# EAGLE schematic IOIO-OTG-v20 (EAGLE 6.3)
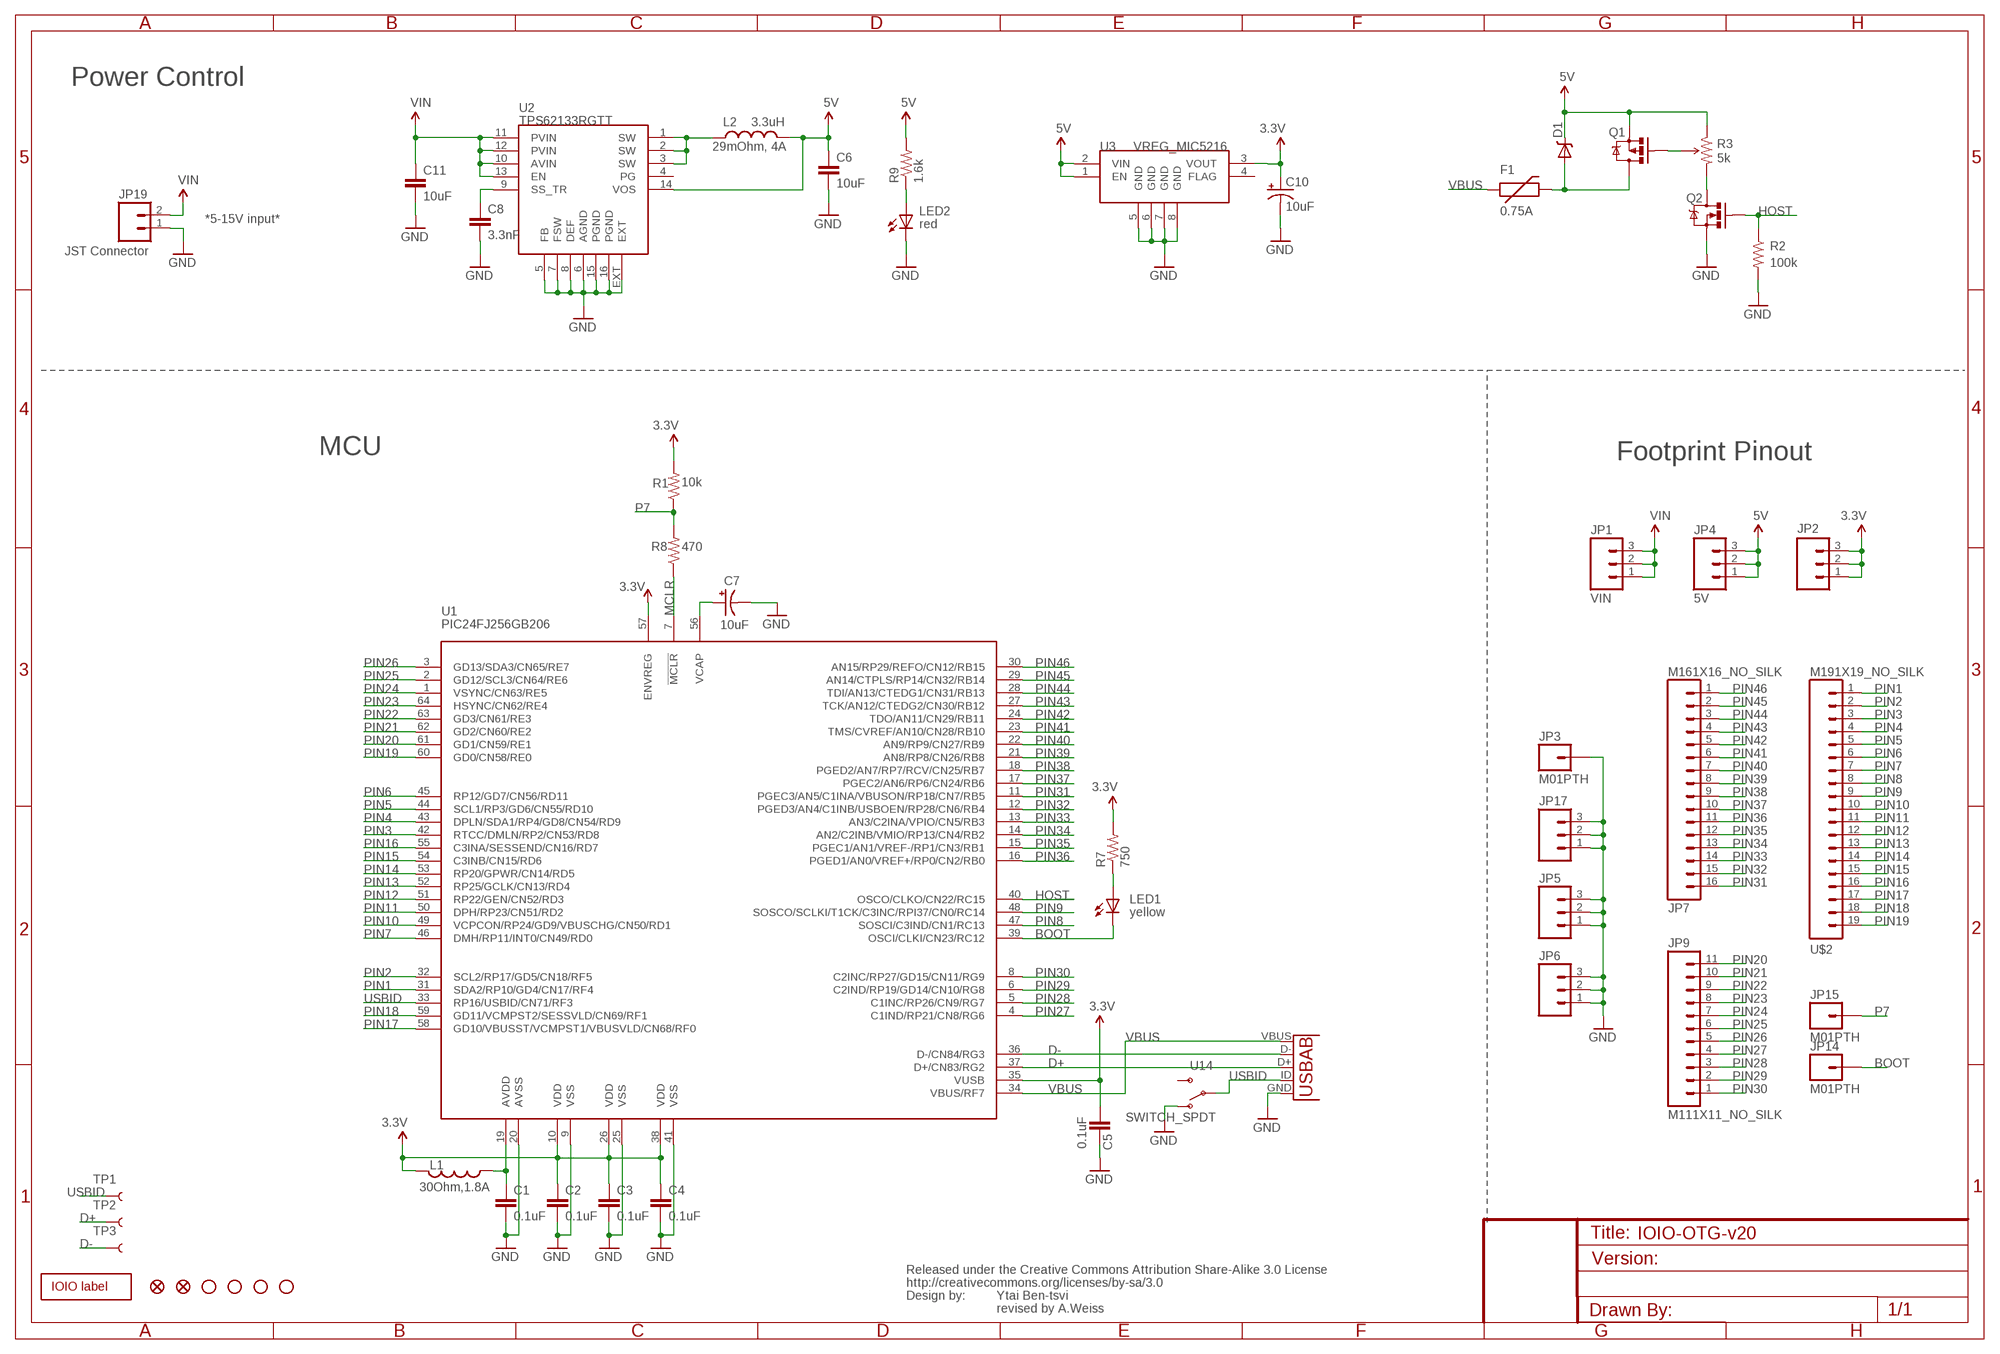
[diagram p0: schematic, sheet 1]

## Parts
C1  0.1uF  CAP0402-CAP  [0402-CAP]
C2  0.1uF  CAP0402-CAP  [0402-CAP]
C3  0.1uF  CAP0402-CAP  [0402-CAP]
C4  0.1uF  CAP0402-CAP  [0402-CAP]
C5  0.1uF  CAP0402-CAP  [0402-CAP]
C6  10uF  CAP0805  [0805]
C7  10uF  CAP_POL1206  [EIA3216]
C8  3.3nF  CAP0402-CAP  [0402-CAP]
C10  10uF  CAP_POL1206  [EIA3216]
C11  10uF  CAP1210  [1210]
D1  B340A  DIODE-SCHOTTKY_  [SMA-DIODE]
F1  PTCSMD  [PTC-1206]
JP1  VIN  M03PTH  [1X03]
JP2  M03PTH  [1X03]
JP3  M01PTH  [1X01]
JP4  5V  M03PTH  [1X03]
JP5  M03PTH  [1X03]
JP6  M03PTH  [1X03]
JP7  M161X16_NO_SILK  [1X16_NO_SILK]
JP8  FIDUCIALUFIDUCIAL  [MICRO-FIDUCIAL]
JP9  M111X11_NO_SILK  [1X11_NO_SILK]
JP10  STAND-OFF  [STAND-OFF]
JP11  STAND-OFF  [STAND-OFF]
JP12  STAND-OFF  [STAND-OFF]
JP13  STAND-OFF  [STAND-OFF]
JP14  M01PTH  [1X01]
JP15  M01PTH  [1X01]
JP16  FIDUCIALUFIDUCIAL  [MICRO-FIDUCIAL]
JP17  M03PTH  [1X03]
JP19  JST Connector  M02-JST-2MM-SMT  [JST-2-SMD]
L1  30Ohm,1.8A  INDUCTOR0402  [C0402]
L2  VLC5045T-3R3N  INDUCTORCR54  [CR54]
LED1  LY L29K-J1K2-26-Z  LED0603  [LED-0603]
LED2  LS L29K-G1J2-1-Z  LED0603  [LED-0603]
Q1  IRLML2244  MOSFET-PCHANNELSMD  [SOT23-3]
Q2  2N7002PW  MOSFET-NCHANNELSOT323  [SOT323]
R1  10k  RESISTOR0402-RES  [0402-RES]
R2  100k  RESISTOR0402-RES  [0402-RES]
R3  TS53YL502MR10  TRIMPOTTRIMPOT-5MM  [TRIMPOT-5MM]
R7  750  RESISTOR0402-RES  [0402-RES]
R8  470  RESISTOR0402-RES  [0402-RES]
R9  1.6k  RESISTOR0402-RES  [0402-RES]
TP1  TEST-POINT3  [PAD.03X.03]
TP2  TEST-POINT3  [PAD.03X.03]
TP3  TEST-POINT3  [PAD.03X.03]
U1  PIC24FJ256GB206  PIC24FXXXDAX06  [PIC24FXXX_TQFP64]
U2  TPS62133RGTT  TPS6214X  [QFN16-3X3MM]
U3  VREG_MIC5216  [MSOP8]
U14  SWITCH_SPDT  [KPS-1290]
U$1  CREATIVE_COMMONS  [CREATIVE_COMMONS]
U$2  M191X19_NO_SILK  [1X19_NO_SILK]
U$3  10104111-0001LF  USB_AB  [USB-AB-MICRO-SMD]
U$6  IOIO-OTG  [IOIO-OTG-COPPER-EXPOSED]

## Nets
3.3V: C2.1 C3.1 C4.1 C5.1 C10.A(+) JP2.1 JP2.2 JP2.3 L1.2 R1.2 R7.2 U1.10(VDD) U1.26(VDD) U1.35(VUSB) U1.38(VDD) U1.57(ENVREG) U3.3(VOUT)
5V: C6.1 D1.C JP4.1 JP4.2 JP4.3 L2.P$2 Q1.2(S) R3.A(CCW) R9.2 U2.14(VOS) U3.1(EN) U3.2(VIN)
BOOT: JP14.1 LED1.C U1.39(OSCI/CLKI/CN23/RC12)
D+: TP2.P$1 U1.37(D+/CN83/RG2) U$3.D+
D-: TP3.P$1 U1.36(D-/CN84/RG3) U$3.D-
GND: C1.2 C2.2 C3.2 C4.2 C5.2 C6.2 C7.C(-) C8.2 C10.C(-) C11.2 JP3.1 JP5.1 JP5.2 JP5.3 JP6.1 JP6.2 JP6.3 JP17.1 JP17.2 JP17.3 JP19.1 LED2.C Q2.2(S) R2.2 U1.9(VSS) U1.20(AVSS) U1.25(VSS) U1.41(VSS) U2.5(FB) U2.6(AGND) U2.7(FSW) U2.8(DEF) U2.15(PGND) U2.16(PGND) U2.EXT U3.5(GND) U3.6(GND) U3.7(GND) U3.8(GND) U14.O U$3.GND
HOST: Q2.1(G) R2.1 U1.40(OSCO/CLKO/CN22/RC15)
MCLR: R8.1 U1.7(!MCLR)
N$1: Q1.1(G) R3.B(WIPER)
N$2: LED1.A R7.1
N$3: LED2.A R9.1
N$4: D1.A F1.2 Q1.3(D)
N$5: C7.A(+) U1.56(VCAP)
N$6: L2.P$1 U2.1(SW) U2.2(SW) U2.3(SW)
N$7: C8.1 U2.9(SS_TR)
N$8: Q2.3(D) R3.C(CW)
N$9: C1.1 L1.1 U1.19(AVDD)
P7: JP15.1 R1.1 R8.2
PIN1: U1.31(SDA2/RP10/GD4/CN17/RF4) U$2.1
PIN2: U1.32(SCL2/RP17/GD5/CN18/RF5) U$2.2
PIN3: U1.42(RTCC/DMLN/RP2/CN53/RD8) U$2.3
PIN4: U1.43(DPLN/SDA1/RP4/GD8/CN54/RD9) U$2.4
PIN5: U1.44(SCL1/RP3/GD6/CN55/RD10) U$2.5
PIN6: U1.45(RP12/GD7/CN56/RD11) U$2.6
PIN7: U1.46(DMH/RP11/INT0/CN49/RD0) U$2.7
PIN8: U1.47(SOSCI/C3IND/CN1/RC13) U$2.8
PIN9: U1.48(SOSCO/SCLKI/T1CK/C3INC/RPI37/CN0/RC14) U$2.9
PIN10: U1.49(VCPCON/RP24/GD9/VBUSCHG/CN50/RD1) U$2.10
PIN11: U1.50(DPH/RP23/CN51/RD2) U$2.11
PIN12: U1.51(RP22/GEN/CN52/RD3) U$2.12
PIN13: U1.52(RP25/GCLK/CN13/RD4) U$2.13
PIN14: U1.53(RP20/GPWR/CN14/RD5) U$2.14
PIN15: U1.54(C3INB/CN15/RD6) U$2.15
PIN16: U1.55(C3INA/SESSEND/CN16/RD7) U$2.16
PIN17: U1.58(GD10/VBUSST/VCMPST1/VBUSVLD/CN68/RF0) U$2.17
PIN18: U1.59(GD11/VCMPST2/SESSVLD/CN69/RF1) U$2.18
PIN19: U1.60(GD0/CN58/RE0) U$2.19
PIN20: JP9.11 U1.61(GD1/CN59/RE1)
PIN21: JP9.10 U1.62(GD2/CN60/RE2)
PIN22: JP9.9 U1.63(GD3/CN61/RE3)
PIN23: JP9.8 U1.64(HSYNC/CN62/RE4)
PIN24: JP9.7 U1.1(VSYNC/CN63/RE5)
PIN25: JP9.6 U1.2(GD12/SCL3/CN64/RE6)
PIN26: JP9.5 U1.3(GD13/SDA3/CN65/RE7)
PIN27: JP9.4 U1.4(C1IND/RP21/CN8/RG6)
PIN28: JP9.3 U1.5(C1INC/RP26/CN9/RG7)
PIN29: JP9.2 U1.6(C2IND/RP19/GD14/CN10/RG8)
PIN30: JP9.1 U1.8(C2INC/RP27/GD15/CN11/RG9)
PIN31: JP7.16 U1.11(PGEC3/AN5/C1INA/VBUSON/RP18/CN7/RB5)
PIN32: JP7.15 U1.12(PGED3/AN4/C1INB/USBOEN/RP28/CN6/RB4)
PIN33: JP7.14 U1.13(AN3/C2INA/VPIO/CN5/RB3)
PIN34: JP7.13 U1.14(AN2/C2INB/VMIO/RP13/CN4/RB2)
PIN35: JP7.12 U1.15(PGEC1/AN1/VREF-/RP1/CN3/RB1)
PIN36: JP7.11 U1.16(PGED1/AN0/VREF+/RP0/CN2/RB0)
PIN37: JP7.10 U1.17(PGEC2/AN6/RP6/CN24/RB6)
PIN38: JP7.9 U1.18(PGED2/AN7/RP7/RCV/CN25/RB7)
PIN39: JP7.8 U1.21(AN8/RP8/CN26/RB8)
PIN40: JP7.7 U1.22(AN9/RP9/CN27/RB9)
PIN41: JP7.6 U1.23(TMS/CVREF/AN10/CN28/RB10)
PIN42: JP7.5 U1.24(TDO/AN11/CN29/RB11)
PIN43: JP7.4 U1.27(TCK/AN12/CTEDG2/CN30/RB12)
PIN44: JP7.3 U1.28(TDI/AN13/CTEDG1/CN31/RB13)
PIN45: JP7.2 U1.29(AN14/CTPLS/RP14/CN32/RB14)
PIN46: JP7.1 U1.30(AN15/RP29/REFO/CN12/RB15)
USBID: TP1.P$1 U1.33(RP16/USBID/CN71/RF3) U14.P U$3.ID(USBID)
VBUS: F1.1 U1.34(VBUS/RF7) U$3.VBUS
VIN: C11.1 JP1.1 JP1.2 JP1.3 JP19.2 U2.10(AVIN) U2.11(PVIN) U2.12(PVIN) U2.13(EN)
Unconnected: U2.4(PG) U3.4(FLAG) U14.S

## Notes on the sheet
- Power Control
- 29mOhm, 4A
- 5k
- 0.75A
- *5-15V input*
- red
- MCU | Footprint Pinout
- yellow
- Ytai Ben-tsvi
- revised by A.Weiss

## Library data of the parts
C1-C5 C8 = SparkFun:CAP: Capacitor Standard 0603 ceramic capacitor, and 0.1" leaded capacitor.
C6 = SparkFun-Passives:CAP: Capacitor Standard 0603 ceramic capacitor, and 0.1" leaded capacitor.; PART#: LMK212BJ106KG-T
C7 = SparkFun:CAP_POL: Capacitor Polarized These are standard SMD and PTH capacitors. Normally 10uF, 47uF, and 100uF in electrolytic and tantalum varieties. Always verify the external diameter of the through hole cap, it varies with capacity, voltage, and manufacturer. The EIA devices should be standard.
C10 = SparkFun-Passives:CAP_POL: Capacitor Polarized These are standard SMD and PTH capacitors. Normally 10uF, 47uF, and 100uF in electrolytic and tantalum varieties. Always verify the external diameter of the through hole cap, it varies with capacity, voltage, and manufacturer. The EIA devices should be standard.; PART#: TAJA106K016RNJ
C11 = SparkFun-Passives:CAP: Capacitor Standard 0603 ceramic capacitor, and 0.1" leaded capacitor.; PART#: UMK325C7106MM-T
D1 = SparkFun-DiscreteSemi:DIODE-SCHOTTKY: Commonly MBRA140.; PART#: B340A
F1 = SparkFun-PowerIC:PTC: Resettable Fuse PTC Resettable Fuse. Spark Fun Electronics SKU : COM-08357; PART#: 0ZCA0075FF2G
JP1 JP2 JP4-JP6 JP17 = SparkFun:M03: Header 3 Standard 3-pin 0.1" header. Use with straight break away headers (SKU : PRT-00116), right angle break away headers (PRT-00553), swiss pins (PRT-00743), machine pins (PRT-00117), and female headers (PRT-00115). Molex polarized connector foot print use with SKU : PRT-08232 with associated crimp pins and housings.
JP3 JP14 JP15 = SparkFun:M01: Header 1 Standard 1-pin 0.1" header. Use with straight break away headers (SKU : PRT-00116), right angle break away headers (PRT-00553), swiss pins (PRT-00743), machine pins (PRT-00117), and female headers (PRT-00115).
JP7 = SparkFun-Connectors:M16: 1x16 .1" header
JP8 JP16 = SparkFun:FIDUCIAL: Fiducial Alignment Points Various fiducial points for machine vision alignment.
JP9 = SparkFun-Connectors:M11: Header 11 Standard 11-pin 0.1" header. Use with straight break away headers (SKU : PRT-00116), right angle break away headers (PRT-00553), swiss pins (PRT-00743), machine pins (PRT-00117), and female headers (PRT-00115).
JP10-JP13 = SparkFun:STAND-OFF: Stand Off This is the mechanical footprint for a #4 phillips button head screw. Use the keepout ring to avoid running the screw head into surrounding components. SKU : PRT-00447
JP19 = SparkFun:M02: Header 2 Standard 2-pin 0.1" header. Use with straight break away headers (SKU : PRT-00116), right angle break away headers (PRT-00553), swiss pins (PRT-00743), machine pins (PRT-00117), and female headers (PRT-00115). Molex polarized connector foot print use with SKU : PRT-08233 with associated crimp pins and housings.
L1 = SparkFun-Passives:INDUCTOR: Inductors Basic Inductor/Choke - 0603 and 1206. Footprints are not proven and vary greatly between part numbers.
L2 = SparkFun-Passives:INDUCTOR: Inductors Basic Inductor/Choke - 0603 and 1206. Footprints are not proven and vary greatly between part numbers.; AM: 3.3uH
LED1 LED2 = SparkFun:LED: LEDs Standard schematic elements and footprints for 5mm, 3mm, 1206, and 0603 sized LEDs. 5mm - Spark Fun Electronics SKU : COM-00529 (and others)
Q1 = SparkFun-DiscreteSemi:MOSFET-PCHANNEL: Generic PMOSFET
Q2 = SparkFun-DiscreteSemi:MOSFET-NCHANNEL: Generic NMOS footprint; PART#: 2N7002PW
R1 R2 R7-R9 = SparkFun:RESISTOR: Resistor Basic schematic elements and footprints for 0603, 1206, and PTH resistors.
R3 = SparkFun-Electromechanical:TRIMPOT: Various small potentiometers for "set-and-forget" applications; PART#: TS53YL502MR10
TP1-TP3 = SparkFun-Passives:TEST-POINT: Bare copper test points for troubleshooting or ICT
U1 = SparkFun-DigitalIC:PIC24FXXXDAX06: PIC24FXXXDAX06 PIC24FXXXDA106 / PIC24FXXXDA206
U2 = SparkFun-PowerIC:TPS6214X: 3-17V, 2A Step Down Converter
U3 = SparkFun-PowerIC:VREG_MIC5216: 500mA LDO, MSOP8 for better dissipation
U14 = SparkFun-Electromechanical:SWITCH_SPDT: Side-actuated SPDT slide switch, as used on the Arduino Pro
U$1 = SparkFun-Aesthetics:CREATIVE_COMMONS: Creative Commons License summary
U$2 = SparkFun-Connectors:M19: 1x19 .1" header
U$3 = SparkFun-Connectors:USB_AB: This is a USB AB connector that is compatible with USB OTG. i.e. this connector can serve as a host or device
U$6 = SparkFun-Aesthetics:IOIO-OTG: Labels for the IOIO-OTG